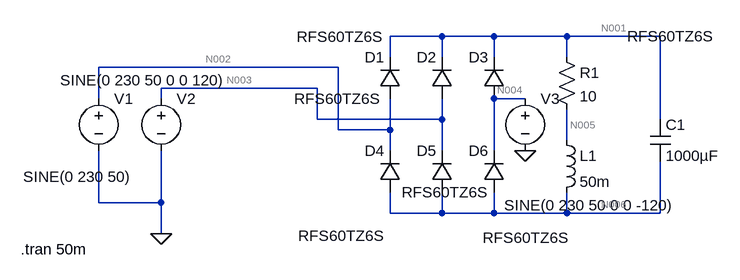
[diagram p0: schematic section2.asc]
section2.asc, the LTspice schematic file:
Version 4
SHEET 1 880 680
WIRE 352 96 272 96
WIRE 432 96 352 96
WIRE 544 96 432 96
WIRE 688 96 544 96
WIRE 272 128 272 96
WIRE 352 128 352 96
WIRE 432 128 432 96
WIRE 544 128 544 96
WIRE 192 144 -176 144
WIRE 160 176 -80 176
WIRE -176 192 -176 144
WIRE -80 192 -80 176
WIRE 480 192 432 192
WIRE 160 224 160 176
WIRE 352 224 352 192
WIRE 352 224 160 224
WIRE 688 224 688 96
WIRE 192 240 192 144
WIRE 272 240 272 192
WIRE 272 240 192 240
WIRE 544 256 544 208
WIRE 272 272 272 240
WIRE 352 272 352 224
WIRE 432 272 432 192
WIRE -176 352 -176 272
WIRE -80 352 -80 272
WIRE -80 352 -176 352
WIRE 272 368 272 336
WIRE 352 368 352 336
WIRE 352 368 272 368
WIRE 432 368 432 336
WIRE 432 368 352 368
WIRE 544 368 544 336
WIRE 544 368 432 368
WIRE 688 368 688 288
WIRE 688 368 544 368
WIRE -80 400 -80 352
FLAG -80 400 0
FLAG 480 272 0
SYMBOL voltage -176 176 R0
WINDOW 3 -116 136 Left 2
WINDOW 123 0 0 Left 0
WINDOW 39 0 0 Left 0
SYMATTR Value SINE(0 230 50)
SYMATTR InstName V1
SYMBOL voltage -80 176 R0
WINDOW 3 -155 -12 Left 2
WINDOW 123 0 0 Left 0
WINDOW 39 0 0 Left 0
SYMATTR Value SINE(0 230 50 0 0 120)
SYMATTR InstName V2
SYMBOL voltage 480 176 R0
WINDOW 3 -32 180 Left 2
WINDOW 123 0 0 Left 0
WINDOW 39 0 0 Left 0
SYMATTR Value SINE(0 230 50 0 0 -120)
SYMATTR InstName V3
SYMBOL diode 288 192 R180
WINDOW 0 24 64 Left 2
WINDOW 3 29 0 Left 2
SYMATTR InstName D1
SYMATTR Value RFS60TZ6S
SYMBOL diode 368 192 R180
WINDOW 0 24 64 Left 2
WINDOW 3 105 95 Left 2
SYMATTR InstName D2
SYMATTR Value RFS60TZ6S
SYMBOL diode 448 192 R180
WINDOW 0 24 64 Left 2
WINDOW 3 -323 96 Left 2
SYMATTR InstName D3
SYMATTR Value RFS60TZ6S
SYMBOL res 528 112 R0
SYMATTR InstName R1
SYMATTR Value 10
SYMBOL ind 528 240 R0
SYMATTR InstName L1
SYMATTR Value 50m
SYMBOL diode 288 336 R180
WINDOW 0 24 64 Left 2
WINDOW 3 23 -67 Left 2
SYMATTR InstName D4
SYMATTR Value RFS60TZ6S
SYMBOL diode 368 336 R180
WINDOW 0 24 64 Left 2
WINDOW 3 -181 -70 Left 2
SYMATTR InstName D5
SYMATTR Value RFS60TZ6S
SYMBOL diode 448 336 R180
WINDOW 0 24 64 Left 2
WINDOW 3 24 0 Left 2
SYMATTR InstName D6
SYMATTR Value RFS60TZ6S
SYMBOL cap 672 224 R0
SYMATTR InstName C1
SYMATTR Value 1000µF
TEXT -296 424 Left 2 !.tran 50m

The netlist it stands for:
* section2.asc
V1 N002 0 SINE(0 230 50)
V2 N003 0 SINE(0 230 50 0 0 120)
V3 N004 0 SINE(0 230 50 0 0 -120)
D1 N002 N001 RFS60TZ6S
D2 N003 N001 RFS60TZ6S
D3 N004 N001 RFS60TZ6S
R1 N001 N005 10
L1 N005 N006 50m
D4 N006 N002 RFS60TZ6S
D5 N006 N003 RFS60TZ6S
D6 N006 N004 RFS60TZ6S
C1 N001 N006 1000µF
.model D D
.lib standard.dio
.tran 50m
.backanno
.end

* Results of the author's LTspice run, read from the files saved beside the schematic
* Operating Point, zero values left out:
*   V(n003) = 199.2 V
*   V(n004) = -199.2 V
*   V(n001) = 197.8 V
*   V(n005) = -197.7 V
*   V(n006) = -197.8 V
*   I(D6) = 39.55 A
*   I(D5) = -67.89 nA
*   I(D4) = -56.53 nA
*   I(D3) = -67.9 nA
*   I(D2) = 39.55 A
*   I(D1) = -56.53 nA
*   I(L1) = 39.55 A
*   I(R1) = 39.55 A
*   I(V3) = 39.55 A
*   I(V2) = -39.55 A
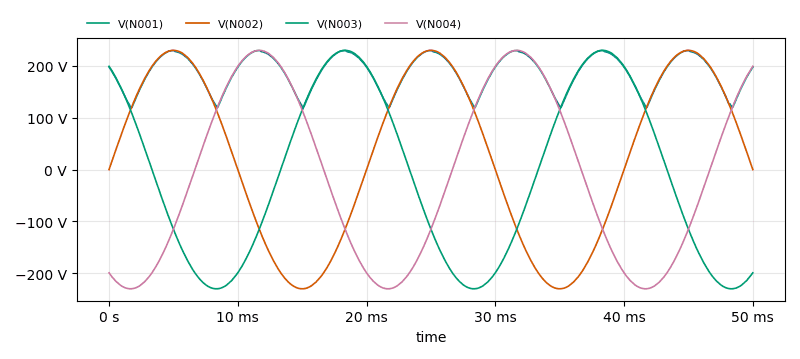
[diagram p1: Transient Analysis of section2.asc, plotted from the saved traces]
* Transient Analysis, 1 run:
*   V(N001): min 115.3 V, max 229.8 V, average 187.2 V, rms 190.3 V, last 197.8 V
*   V(N002): min -230 V, max 230 V, average 29.27 V, rms 162.6 V, last 0 V
*   V(N003): min -230 V, max 230 V, average -14.64 V, rms 162.6 V, last -199.2 V
*   V(N004): min -230 V, max 230 V, average -14.64 V, rms 162.6 V, last 199.2 V